# EAGLE design ESC-Beta (EAGLE 9.6.2)
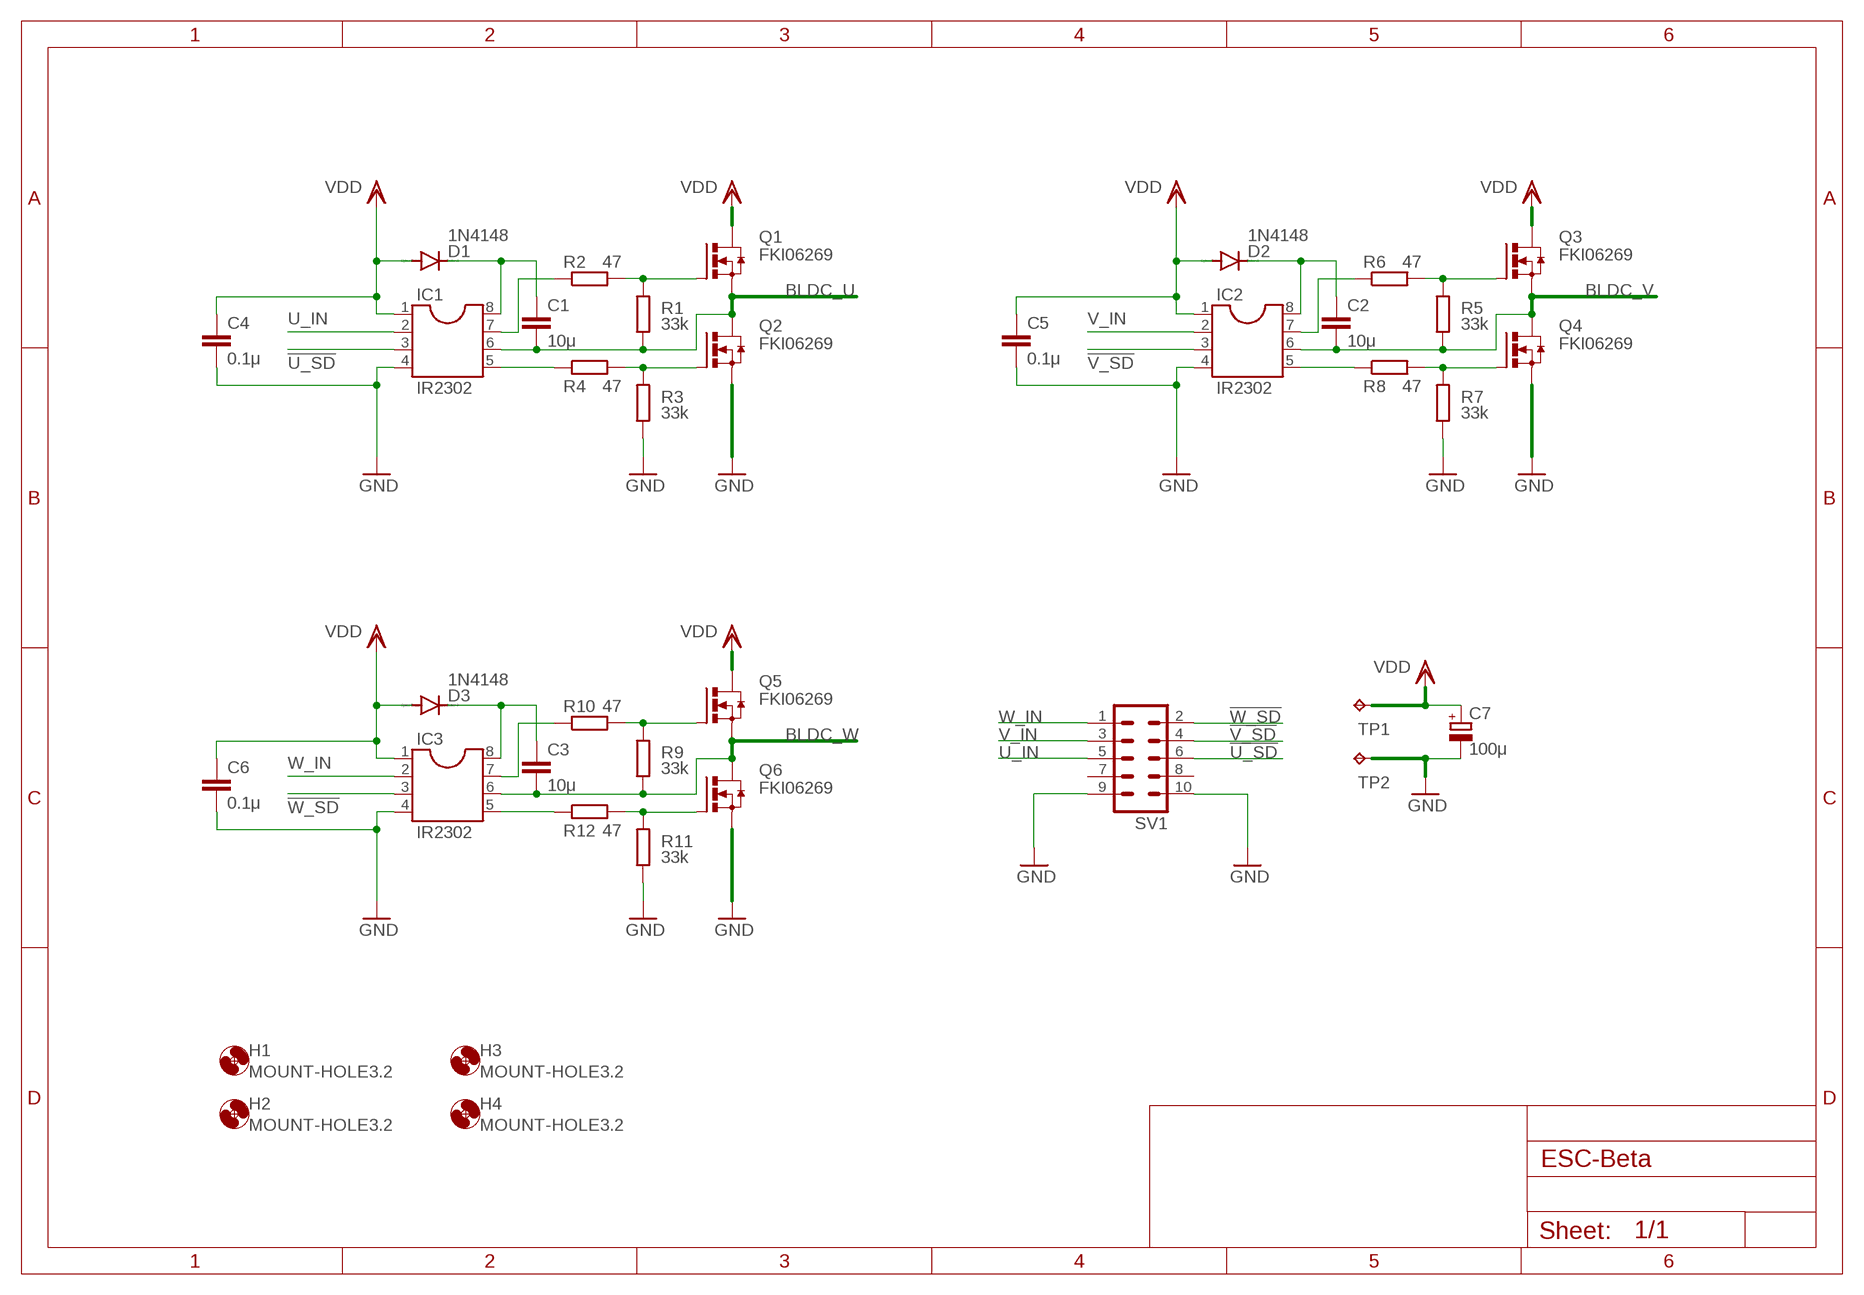
[diagram p0: schematic, sheet 1]

## Parts
C1  10μ  C-EU050-024X044  [C050-024X044]
C2  10μ  C-EU050-024X044  [C050-024X044]
C3  10μ  C-EU050-024X044  [C050-024X044]
C4  0.1μ  C-EU050-024X044  [C050-024X044]
C5  0.1μ  C-EU050-024X044  [C050-024X044]
C6  0.1μ  C-EU050-024X044  [C050-024X044]
C7  100μ  CPOL-EUE5-8.5  [E5-8,5]
D1  1N4148  1N4148DO35-7  [DO35-7]
D2  1N4148  1N4148DO35-7  [DO35-7]
D3  1N4148  1N4148DO35-7  [DO35-7]
H1  MOUNT-HOLE3.2  [3,2]
H2  MOUNT-HOLE3.2  [3,2]
H3  MOUNT-HOLE3.2  [3,2]
H4  MOUNT-HOLE3.2  [3,2]
IC1  IR2302  DIL8S  [SOCKET-08]
IC2  IR2302  DIL8S  [SOCKET-08]
IC3  IR2302  DIL8S  [SOCKET-08]
Q1  FKI06269  IRF3704-H  [TO220BH]
Q2  FKI06269  IRF3704-H  [TO220BH]
Q3  FKI06269  IRF3704-H  [TO220BH]
Q4  FKI06269  IRF3704-H  [TO220BH]
Q5  FKI06269  IRF3704-H  [TO220BH]
Q6  FKI06269  IRF3704-H  [TO220BH]
R1  33k  R-EU_0207/10  [0207/10]
R2  47  R-EU_0207/10  [0207/10]
R3  33k  R-EU_0207/10  [0207/10]
R4  47  R-EU_0207/10  [0207/10]
R5  33k  R-EU_0207/10  [0207/10]
R6  47  R-EU_0207/10  [0207/10]
R7  33k  R-EU_0207/10  [0207/10]
R8  47  R-EU_0207/10  [0207/10]
R9  33k  R-EU_0207/10  [0207/10]
R10  47  R-EU_0207/10  [0207/10]
R11  33k  R-EU_0207/10  [0207/10]
R12  47  R-EU_0207/10  [0207/10]
SV1  ML10  [ML10]
TP1  TPPAD1-20  [P1-20]
TP2  TPPAD1-20  [P1-20]

## Nets
!U_SD: IC1.3 SV1.6
!V_SD: IC2.3 SV1.4
!W_SD: IC3.3 SV1.2
BLDC_U: C1.2 IC1.6 Q1.S Q2.D R1.1
BLDC_V: C2.2 IC2.6 Q3.S Q4.D R5.1
BLDC_W: C3.2 IC3.6 Q5.S Q6.D R9.1
GND: C4.2 C5.2 C6.2 C7.- IC1.4 IC2.4 IC3.4 Q2.S Q4.S Q6.S R3.1 R7.1 R11.1 SV1.9 SV1.10 TP2.TP
N$1: Q1.G R1.2 R2.2
N$2: Q3.G R5.2 R6.2
N$3: C1.1 D1.C IC1.8
N$4: IC1.7 R2.1
N$5: Q2.G R3.2 R4.2
N$6: C2.1 D2.C IC2.8
N$7: IC1.5 R4.1
N$8: IC2.7 R6.1
N$9: Q4.G R7.2 R8.2
N$10: IC2.5 R8.1
N$11: Q5.G R9.2 R10.2
N$12: C3.1 D3.C IC3.8
N$13: IC3.7 R10.1
N$14: Q6.G R11.2 R12.2
N$15: IC3.5 R12.1
U_IN: IC1.2 SV1.5
V_IN: IC2.2 SV1.3
VDD: C4.1 C5.1 C6.1 C7.+ D1.A D2.A D3.A IC1.1 IC2.1 IC3.1 Q1.D Q3.D Q5.D TP1.TP
W_IN: IC3.2 SV1.1
Unconnected: SV1.7 SV1.8

## Library data of the parts
C1-C6 = rcl:C-EU: CAPACITOR, European symbol; SPICEPREFIX: C
C7 = rcl:CPOL-EU: POLARIZED CAPACITOR, European symbol; SPICEPREFIX: C
D1-D3 = diode:1N4148: DIODE high speed (Philips)
H1-H4 = holes:MOUNT-HOLE: MOUNTING HOLE with drill center marker
IC1-IC3 = ic-package:DIL8: Dual In Line / Socket
Q1-Q6 = transistor-power:IRF3704: SMPS MOSFET HEXFET® Power MOSFET Source: http://www.irf.com/product-info/datasheets/data/irf3704.pdf
R1-R12 = rcl:R-EU_: RESISTOR, European symbol; SPICEPREFIX: R
SV1 = con-ml:ML10: HARTING; OC_FARNELL: unknown; OC_NEWARK: unknown
TP1 TP2 = testpad:TP: Test pad

## Board
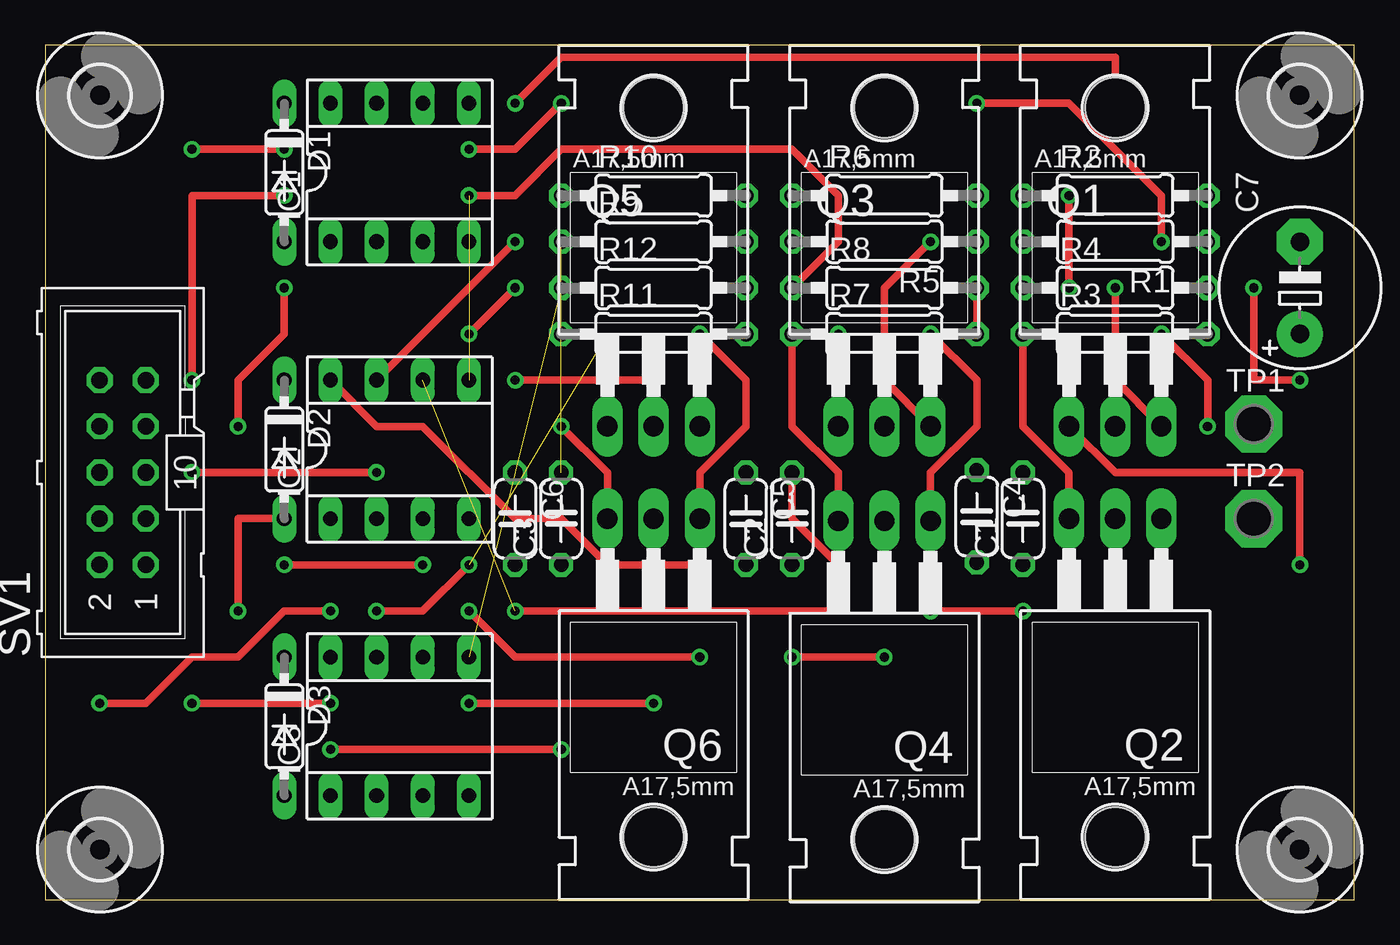
[diagram p1: board, top side]
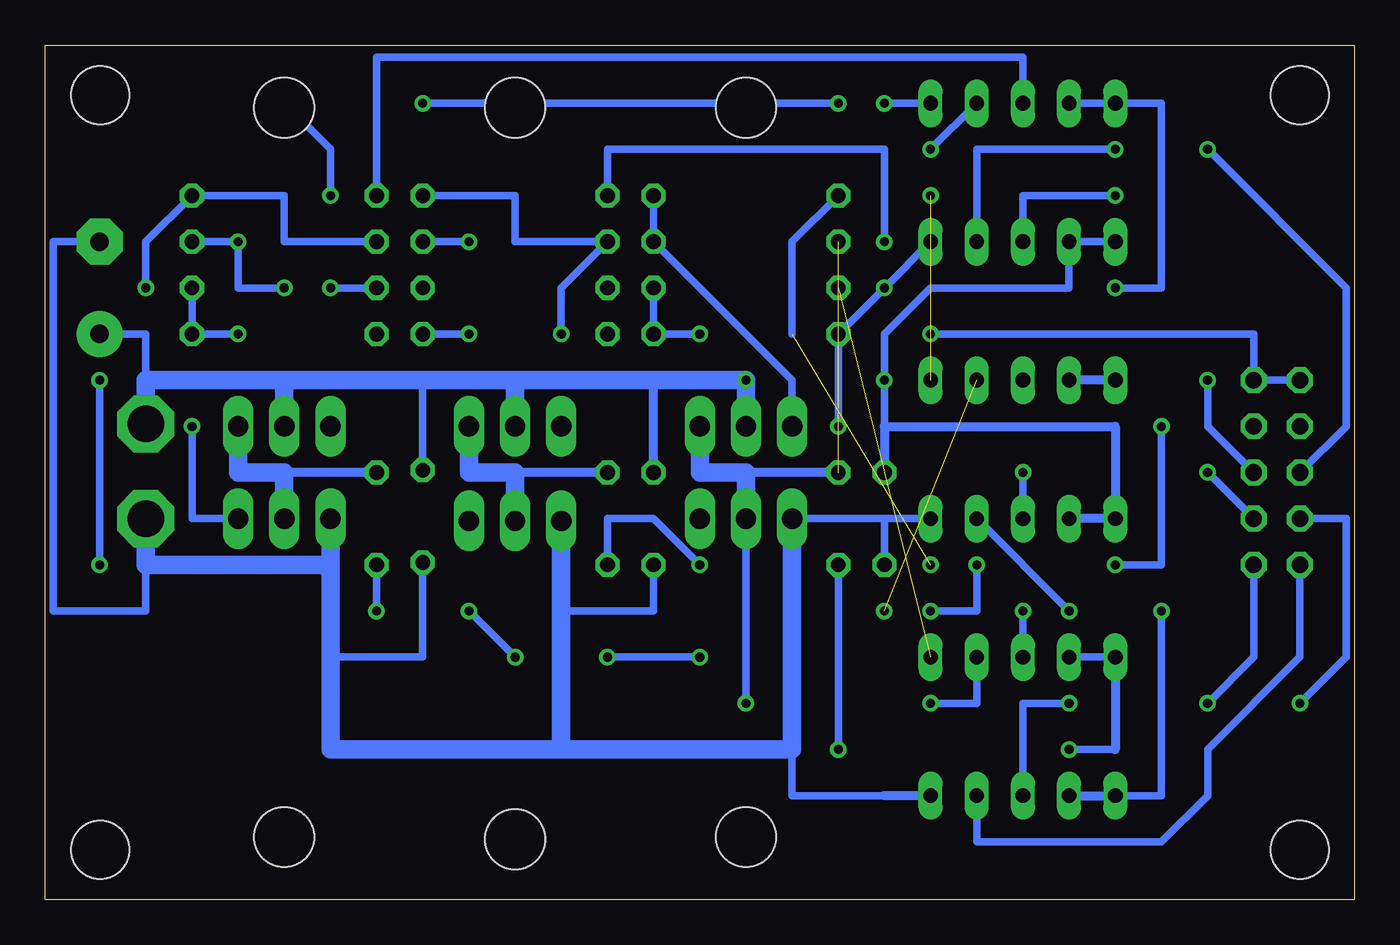
[diagram p2: board, bottom side, seen from below]

Size 72 x 47 mm. Coordinates in mm from the lower left corner, seen from the top.
Outline: 0,0 72,0 72,47 0,47 0,0
Copper layers (1*16): Top 0.035mm / dielectric 1.5mm / Bottom 0.035mm
Design rules "default *": minimum track width 6mil, minimum drill 0.35mm, track to track 6mil, track to pad 6mil, pad to pad 6mil, via to via 6mil, smd to smd 6mil, copper to edge 0mil, drill to drill 6mil, minimum pad ring 10mil, minimum via ring 8mil, stop-mask expansion 4mil, vias tented up to drill 0mil, thermal gap 10mil

### Footprints (pad centres in the part's own frame; a part is rotated, then mirrored left to right if it is on the bottom)
C050-024X044 = drill 0.813 octagon: 1 -2.54,0; 2 2.54,0
E5-8,5 = drill 1.016 pad 2.54: + -2.54,0 | drill 1.016 pad 2.54 octagon: - 2.54,0
DO35-7 = drill 0.813 long: A 3.81,0; C -3.81,0
3,2 = hole 3.2: 0,0
SOCKET-08 = drill 0.813 long: 1 -3.81,-3.81; 2 -1.27,-3.81; 3 1.27,-3.81; 4 3.81,-3.81; 5 3.81,3.81; 6 1.27,3.81; 7 -1.27,3.81; 8 -3.81,3.81
TO220BH = drill 1.118 long: D 0,-6.35; G -2.54,-6.35; S 2.54,-6.35 | hole 3.302: 0,11.176
0207/10 = drill 0.813 octagon: 1 -5.08,0; 2 5.08,0
ML10 = drill 0.914 octagon: 1 -5.08,-1.27; 2 -5.08,1.27; 3 -2.54,-1.27; 4 -2.54,1.27; 5 0,-1.27; 6 0,1.27; 7 2.54,-1.27; 8 2.54,1.27; 9 5.08,-1.27; 10 5.08,1.27
P1-20 = drill 2.007 pad 3.15 octagon: TP 0,0

### Placement (x,y rotation side)
C1  53.78,20.96 90 top
C2  41.08,20.96 90 top
C3  28.38,20.96 90 top
C4  51.24,21.09 270 top
C5  38.54,20.96 270 top
C6  25.84,20.96 270 top
C7  69.02,33.66 90 top
D1  13.14,40.01 270 top
D2  13.14,24.77 270 top
D3  13.14,9.53 270 top
H1  3,44.25 0 top
H2  69,44.25 0 top
H3  3,2.75 0 top
H4  69,2.75 0 top
IC1  19.49,40.01 0 top
IC2  19.49,24.77 0 top
IC3  19.49,9.53 0 top
Q1  58.86,32.39 0 top
Q2  58.86,14.61 180 top
Q3  46.16,32.39 0 top
Q4  46.16,14.48 180 top
Q5  33.46,32.39 0 top
Q6  33.46,14.61 180 top
R1  58.86,36.2 180 top
R2  58.86,38.74 0 top
R3  58.86,31.12 0 top
R4  58.86,33.66 0 top
R5  46.16,36.2 180 top
R6  46.16,38.74 0 top
R7  46.16,31.12 0 top
R8  46.16,33.66 0 top
R9  33.46,36.2 0 top
R10  33.46,38.74 0 top
R11  33.46,31.12 0 top
R12  33.46,33.66 0 top
SV1  4.25,23.5 90 top
TP1  66.48,26.17 0 top
TP2  66.48,20.96 0 top

### Tracks (layer width: path | path; a pad name or v marks a point on that pad's centre or on a via)
!U_SD  (via drill 0.5)
  Top 0.406: v8.06,41.28 v13.14,41.28
  Bottom 0.406: SV1.6 0.44,26.04 0.44,33.66 v8.06,41.28 | v13.14,41.28 20.76,41.28 IC1.3
!V_SD  (via drill 0.5)
  Top 0.406: v2.98,10.8 5.52,10.8 8.06,13.34 10.6,13.34 13.14,15.88 v15.68,15.88
  Bottom 0.406: SV1.4 0.44,20.96 0.44,13.34 v2.98,10.8 | IC2.3 v15.68,15.88
!W_SD
  Bottom 0.406: IC3.3 20.76,3.18 10.6,3.18 8.06,5.72 8.06,8.26 2.98,13.34 SV1.2
BLDC_U  (via drill 0.5)
  Top 0.406: Q1.S 58.86,28.58 v58.86,33.66 | v23.3,41.28 25.84,41.28 v28.38,43.82 | v51.24,43.82 56.32,43.82 61.4,38.74 v61.4,36.2
  Bottom 0.406: R1.1 v61.4,36.2 61.4,33.66 v58.86,33.66 | IC1.6 v23.3,41.28 | v28.38,43.82 v51.24,43.82
  Bottom 0.508: C1.2 58.86,23.5
  Bottom 1.016: Q2.D 58.86,23.5 61.4,23.5 Q1.S
BLDC_V  (via drill 0.5)  (1 unrouted)
  Top 0.406: v48.7,36.2 46.16,33.66 46.16,28.58 Q3.S | C2.2 41.08,20.96 43.62,18.42 43.62,15.88 v25.84,15.88
  Bottom 0.406: R5.1 v48.7,36.2
  Bottom 0.508: C2.2 46.16,23.5
  Bottom 1.016: Q4.D 46.16,23.5 48.7,23.5 Q3.S
BLDC_W  (via drill 0.5)  (1 unrouted)
  Top 0.406: v23.3,10.8 v33.46,10.8
  Bottom 0.406: IC3.6 20.76,10.8 v23.3,10.8 | v33.46,10.8 Q6.D
  Bottom 0.508: C3.2 33.46,23.5
  Bottom 1.016: Q6.D 33.46,23.5 36,23.5 Q5.S
GND  (via drill 0.5)
  Top 0.406: Q4.S 43.62,23.5 41.08,26.04 R7.1 | v23.3,31.12 v25.84,33.66 | v28.38,26.04 30.92,23.5 Q6.S | Q2.S 56.32,23.5 53.78,26.04 R3.1
  Bottom 0.406: C5.2 38.54,15.88 43.62,15.88 | C4.2 51.24,13.34 56.32,13.34 | IC1.4 v25.84,33.66 R11.1 v28.38,26.04 | SV1.10 SV1.9 5.52,31.12 v23.3,31.12 | Q6.S 25.84,20.96 | 25.84,20.96 IC2.4 | C6.2 25.84,20.96 | C7.- 71.56,36.2 71.56,15.88 66.48,15.88 66.48,18.42 | 25.84,5.72 30.92,5.72 30.92,8.26
  Bottom 0.508: IC3.4 25.84,5.72
  Bottom 1.016: 43.62,8.26 30.92,8.26 Q6.S | 43.62,8.26 56.32,8.26 56.32,13.34 56.32,18.42 | 56.32,18.42 Q2.S | Q4.S 43.62,15.88 43.62,8.26 | TP2.TP 66.48,18.42 56.32,18.42
N$1  (via drill 0.5)
  Top 0.406: Q1.G 58.86,23.5 69.02,23.5 v69.02,18.42 | v69.02,28.58 66.48,28.58 v66.48,33.66
  Bottom 0.406: v66.48,33.66 66.48,36.2 R2.2 58.86,38.74 58.86,36.2 R1.2 | v69.02,28.58 v69.02,18.42
N$2  (via drill 0.5)
  Top 0.406: v43.62,31.12 Q3.G
  Bottom 0.406: v43.62,31.12 43.62,33.66 R5.2 46.16,36.2 46.16,38.74 R6.2
N$3  (via drill 0.5)
  Top 0.406: v13.14,33.66 13.14,31.12 10.6,28.58 v10.6,26.04 | v41.08,13.34 v46.16,13.34 | v48.7,15.88 v53.78,15.88 | v23.3,15.88 25.84,13.34 v36,13.34 | v13.14,18.42 v20.76,18.42
  Bottom 0.406: D1.C IC1.8 10.6,43.82 10.6,33.66 v13.14,33.66 | v13.14,18.42 10.6,18.42 v10.6,26.04 | v23.3,15.88 20.76,15.88 v20.76,18.42 | v36,13.34 v41.08,13.34 | v46.16,13.34 v48.7,15.88 | v53.78,15.88 C1.1
N$4
  Bottom 0.406: IC1.7 18.22,46.36 53.78,46.36 R2.1
N$5  (via drill 0.5)
  Top 0.406: v63.94,26.04 63.94,28.58 v61.4,31.12
  Bottom 0.406: v61.4,31.12 R3.2 R4.2 | Q2.G 63.94,20.96 v63.94,26.04
N$6  (via drill 0.5)
  Top 0.406: IC2.8 18.22,26.04 20.76,26.04 25.84,20.96 28.38,20.96 30.92,18.42 v36,18.42
  Bottom 0.406: v36,18.42 38.54,20.96 41.08,20.96 C2.1
  Bottom 0.508: D2.C IC2.8
N$7  (via drill 0.5)
  Top 0.406: v25.84,43.82 28.38,46.36 58.86,46.36 v58.86,43.82 | v56.32,38.74 v56.32,33.66
  Bottom 0.406: IC1.5 v25.84,43.82 | v58.86,43.82 56.32,41.28 v56.32,38.74 | v56.32,33.66 R4.1
N$8  (via drill 0.5)
  Top 0.406: IC2.7 v25.84,36.2
  Bottom 0.406: R6.1 41.08,41.28 25.84,41.28 v25.84,36.2
N$9  (via drill 0.5)
  Top 0.406: v48.7,31.12 51.24,28.58 51.24,26.04 48.7,23.5 Q4.G | R7.2 R8.2
  Bottom 0.406: R7.2 v48.7,31.12
N$10  (via drill 0.5)  (1 unrouted)
  Top 0.406: R8.1 43.62,36.2 43.62,38.74 41.08,41.28 28.38,41.28 25.84,38.74 v23.3,38.74
N$11
  Bottom 0.406: Q5.G 30.92,28.58 R9.2 R10.2
N$12  (via drill 0.5)
  Top 0.406: v15.68,8.26 v28.38,8.26
  Bottom 0.406: 13.14,8.26 v15.68,8.26 | C3.1 v28.38,8.26 | D3.C IC3.8
  Bottom 0.508: D3.C 13.14,8.26
N$13  (via drill 0.5)  (1 unrouted)
  Top 0.406: v18.22,15.88 20.76,15.88 v23.3,18.42
  Bottom 0.406: R10.1 30.92,36.2 30.92,31.12 | IC3.7 v18.22,15.88
N$14  (via drill 0.5)
  Top 0.406: Q6.G 36,23.5 38.54,26.04 38.54,28.58 v36,31.12
  Bottom 0.406: v36,31.12 R11.2 R12.2
N$15  (1 unrouted)
U_IN  (via drill 0.5)
  Top 0.406: v8.06,28.58 8.06,38.74 v13.14,38.74
  Bottom 0.406: SV1.5 8.06,26.04 v8.06,28.58 | v13.14,38.74 18.22,38.74 IC1.2
V_IN  (via drill 0.5)
  Top 0.406: v18.22,23.5 v8.06,23.5
  Bottom 0.406: IC2.2 v18.22,23.5 | v8.06,23.5 SV1.3
VDD  (via drill 0.5)
  Top 0.406: v25.84,28.58 v33.46,28.58 | D2.A 10.6,20.96 v10.6,15.88
  Bottom 0.406: 66.48,28.58 66.48,31.12 C7.+ | D1.A IC1.1 15.68,33.66 23.3,33.66 25.84,31.12 v25.84,28.58 C6.1 | D3.A 10.6,5.72 v10.6,15.88 | C4.1 51.24,28.58
  Bottom 0.508: C5.1 38.54,28.58 | IC2.1 D2.A 13.14,26.04 25.84,26.04 C6.1 | IC3.1 D3.A
  Bottom 1.016: Q1.D 58.86,28.58 | Q3.D 46.16,28.58 | 58.86,28.58 51.24,28.58 46.16,28.58 | 46.16,28.58 38.54,28.58 v33.46,28.58 Q5.D | TP1.TP 66.48,28.58 58.86,28.58
W_IN  (via drill 0.5)
  Top 0.406: v15.68,10.8 v8.06,10.8
  Bottom 0.406: IC3.2 18.22,10.8 v15.68,10.8 | v8.06,10.8 5.52,13.34 SV1.1